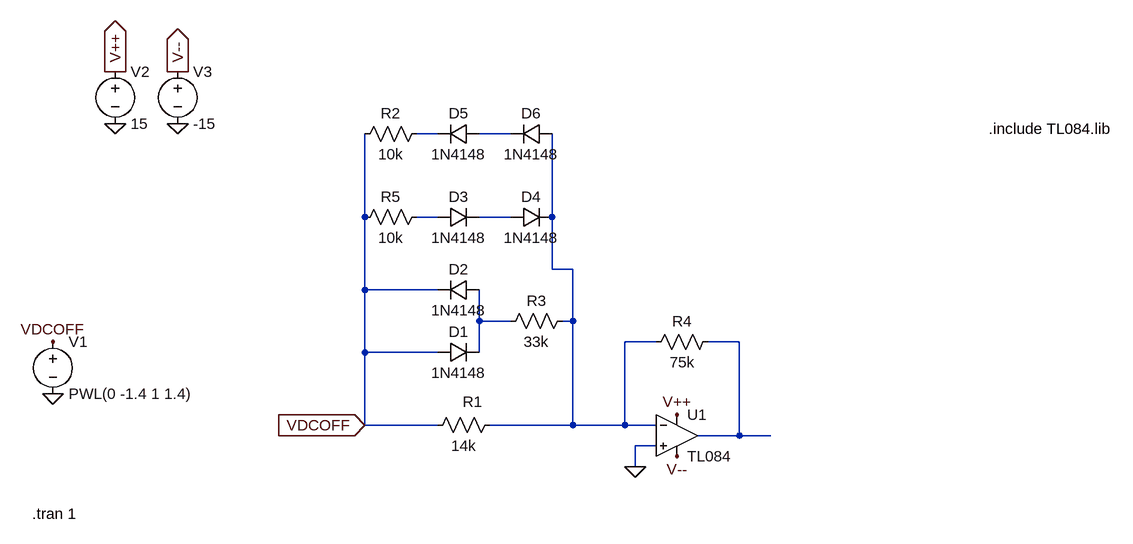
[diagram p0: schematic arc sine.asc]
arc sine.asc, the LTspice schematic file:
Version 4
SHEET 1 1120 680
WIRE 64 -32 32 -32
WIRE 176 -32 128 -32
WIRE -48 96 -48 -32
WIRE 64 96 32 96
WIRE 176 96 128 96
WIRE 240 96 240 -32
WIRE 240 176 240 96
WIRE 272 176 240 176
WIRE -48 208 -48 96
WIRE 64 208 -48 208
WIRE 128 256 128 208
WIRE 176 256 128 256
WIRE 272 256 272 176
WIRE 272 256 256 256
WIRE 400 288 352 288
WIRE 528 288 480 288
WIRE -48 304 -48 208
WIRE 64 304 -48 304
WIRE 128 304 128 256
WIRE -48 416 -48 304
WIRE 64 416 -48 416
WIRE 272 416 272 256
WIRE 272 416 144 416
WIRE 352 416 352 288
WIRE 352 416 272 416
WIRE 400 416 352 416
WIRE 528 432 528 288
WIRE 528 432 464 432
WIRE 576 432 528 432
WIRE 400 448 368 448
WIRE 368 480 368 448
FLAG 368 480 0
FLAG -48 416 VDCOFF
IOPIN -48 416 In
FLAG -528 368 0
FLAG -528 288 VDCOFF
FLAG -432 -48 0
FLAG -336 -48 0
FLAG -432 -128 V++
IOPIN -432 -128 Out
FLAG -336 -128 V--
IOPIN -336 -128 Out
FLAG 432 400 V++
FLAG 432 464 V--
SYMBOL res 160 400 R90
WINDOW 0 -4 42 VBottom 2
WINDOW 3 32 56 VTop 2
SYMATTR InstName R1
SYMATTR Value 14k
SYMBOL diode 64 320 R270
WINDOW 0 32 32 VTop 2
WINDOW 3 0 32 VBottom 2
SYMATTR InstName D1
SYMATTR Value 1N4148
SYMBOL diode 128 192 R90
WINDOW 0 0 32 VBottom 2
WINDOW 3 32 32 VTop 2
SYMATTR InstName D2
SYMATTR Value 1N4148
SYMBOL diode 64 112 R270
WINDOW 0 32 32 VTop 2
WINDOW 3 0 32 VBottom 2
SYMATTR InstName D3
SYMATTR Value 1N4148
SYMBOL diode 176 112 R270
WINDOW 0 32 32 VTop 2
WINDOW 3 0 32 VBottom 2
SYMATTR InstName D4
SYMATTR Value 1N4148
SYMBOL diode 128 -48 R90
WINDOW 0 0 32 VBottom 2
WINDOW 3 32 32 VTop 2
SYMATTR InstName D5
SYMATTR Value 1N4148
SYMBOL diode 240 -48 R90
WINDOW 0 0 32 VBottom 2
WINDOW 3 32 32 VTop 2
SYMATTR InstName D6
SYMATTR Value 1N4148
SYMBOL res 48 -48 R90
WINDOW 0 0 56 VBottom 2
WINDOW 3 32 56 VTop 2
SYMATTR InstName R2
SYMATTR Value 10k
SYMBOL res 272 240 R90
WINDOW 0 0 56 VBottom 2
WINDOW 3 32 56 VTop 2
SYMATTR InstName R3
SYMATTR Value 33k
SYMBOL res 48 80 R90
WINDOW 0 0 56 VBottom 2
WINDOW 3 32 56 VTop 2
SYMATTR InstName R5
SYMATTR Value 10k
SYMBOL voltage -528 272 R0
WINDOW 123 0 0 Left 0
WINDOW 39 0 0 Left 0
SYMATTR InstName V1
SYMATTR Value PWL(0 -1.4 1 1.4)
SYMBOL voltage -432 -144 R0
SYMATTR InstName V2
SYMATTR Value 15
SYMBOL voltage -336 -144 R0
SYMATTR InstName V3
SYMATTR Value -15
SYMBOL Opamps\\opamp2 432 368 R0
SYMATTR InstName U1
SYMATTR Value TL084
SYMBOL res 496 272 R90
WINDOW 0 0 56 VBottom 2
WINDOW 3 32 56 VTop 2
SYMATTR InstName R4
SYMATTR Value 75k
TEXT 912 -40 Left 2 !.include TL084.lib
TEXT -560 552 Left 2 !.tran 1

The netlist it stands for:
* arc sine.asc
R1 N005 VDCOFF 14k
D1 VDCOFF N006 1N4148
D2 N006 VDCOFF 1N4148
D3 N003 N004 1N4148
D4 N004 N005 1N4148
D5 N002 N001 1N4148
D6 N005 N002 1N4148
R2 N001 VDCOFF 10k
R3 N005 N006 33k
R5 N003 VDCOFF 10k
V1 VDCOFF 0 PWL(0 -1.4 1 1.4)
V2 V++ 0 15
V3 V-- 0 -15
XU1 0 N005 V++ V-- N007 TL084  ; pins In+ In- V+ V- OUT
R4 N007 N005 75k
.model D D
.lib standard.dio
.include TL084.lib
.tran 1
.backanno
.end